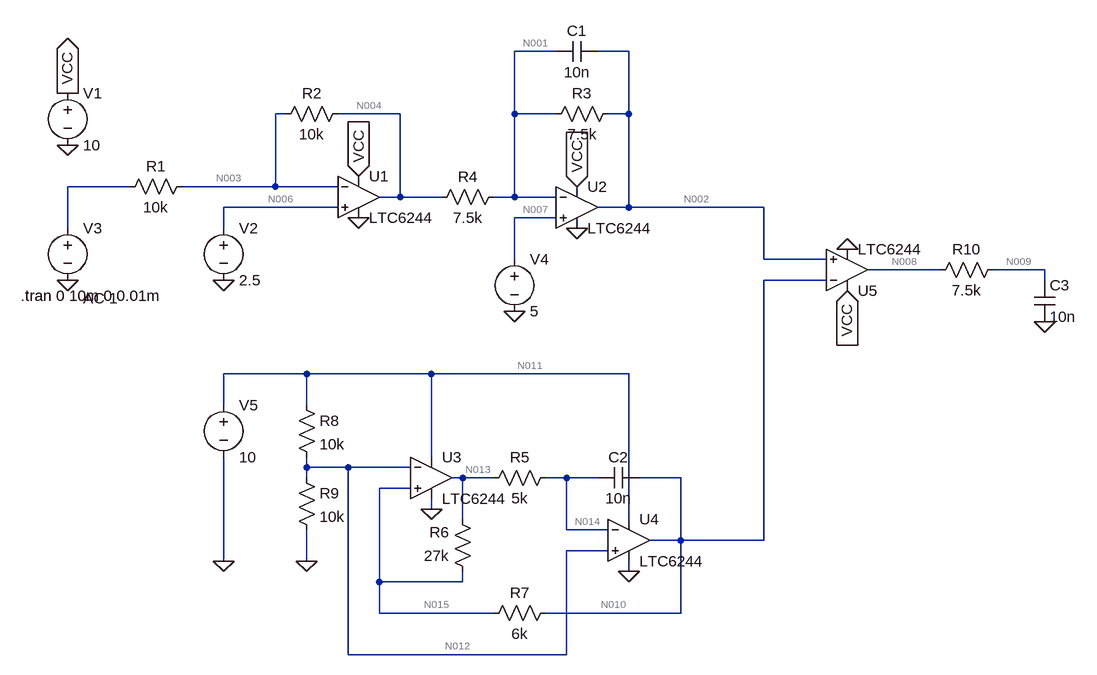
[diagram p0: schematic CombinedInput.asc]
CombinedInput.asc, the LTspice schematic file:
Version 4
SHEET 1 1496 884
WIRE 672 -48 608 -48
WIRE 784 -48 736 -48
WIRE 256 48 240 48
WIRE 432 48 336 48
WIRE 608 48 608 -48
WIRE 672 48 608 48
WIRE 784 48 784 -48
WIRE 784 48 752 48
WIRE 16 160 -80 160
WIRE 240 160 240 48
WIRE 240 160 96 160
WIRE 336 160 240 160
WIRE 432 176 432 48
WIRE 432 176 400 176
WIRE 496 176 432 176
WIRE 608 176 608 48
WIRE 608 176 576 176
WIRE 672 176 608 176
WIRE 336 192 160 192
WIRE 784 192 784 48
WIRE 784 192 736 192
WIRE 992 192 784 192
WIRE 672 208 608 208
WIRE -80 224 -80 160
WIRE 160 224 160 192
WIRE 608 272 608 208
WIRE 992 272 992 192
WIRE 1088 272 992 272
WIRE 1264 288 1152 288
WIRE 1424 288 1344 288
WIRE 1088 304 992 304
WIRE 1424 304 1424 288
WIRE 288 448 160 448
WIRE 480 448 288 448
WIRE 784 448 480 448
WIRE 160 496 160 448
WIRE 288 496 288 448
WIRE 480 576 480 448
WIRE 288 592 288 576
WIRE 352 592 288 592
WIRE 448 592 352 592
WIRE 288 608 288 592
WIRE 528 608 512 608
WIRE 576 608 528 608
WIRE 688 608 656 608
WIRE 736 608 688 608
WIRE 864 608 800 608
WIRE 448 624 400 624
WIRE 480 656 480 640
WIRE 528 672 528 608
WIRE 784 672 784 448
WIRE 688 688 688 608
WIRE 752 688 688 688
WIRE 864 704 864 608
WIRE 864 704 816 704
WIRE 992 704 992 304
WIRE 992 704 864 704
WIRE 752 720 688 720
WIRE 160 736 160 576
WIRE 288 736 288 688
WIRE 784 752 784 736
WIRE 400 768 400 624
WIRE 528 768 528 752
WIRE 528 768 400 768
WIRE 400 816 400 768
WIRE 576 816 400 816
WIRE 864 816 864 704
WIRE 864 816 656 816
WIRE 352 880 352 592
WIRE 688 880 688 720
WIRE 688 880 352 880
FLAG 368 208 0
FLAG -80 96 0
FLAG -80 304 0
FLAG 160 304 0
FLAG -80 16 VCC
IOPIN -80 16 Out
FLAG 368 144 VCC
IOPIN 368 144 In
FLAG 704 224 0
FLAG 704 160 VCC
IOPIN 704 160 In
FLAG 608 352 0
FLAG 1120 320 VCC
IOPIN 1120 320 In
FLAG 1120 256 0
FLAG 288 736 0
FLAG 480 656 0
FLAG 784 752 0
FLAG 160 736 0
FLAG 1424 368 0
SYMBOL Opamps\\LTC6244 368 176 R0
SYMATTR InstName U1
SYMBOL voltage -80 0 R0
WINDOW 123 0 0 Left 0
WINDOW 39 0 0 Left 0
SYMATTR InstName V1
SYMATTR Value 10
SYMBOL voltage 160 208 R0
WINDOW 123 0 0 Left 0
WINDOW 39 0 0 Left 0
SYMATTR InstName V2
SYMATTR Value 2.5
SYMBOL voltage -80 208 R0
WINDOW 123 24 124 Left 2
WINDOW 39 0 0 Left 0
WINDOW 3 24 96 Invisible 2
SYMATTR Value2 AC 1
SYMATTR InstName V3
SYMATTR Value SINE(0 1 200)
SYMBOL res 112 144 R90
WINDOW 0 0 56 VBottom 2
WINDOW 3 32 56 VTop 2
SYMATTR InstName R1
SYMATTR Value 10k
SYMBOL res 352 32 R90
WINDOW 0 0 56 VBottom 2
WINDOW 3 32 56 VTop 2
SYMATTR InstName R2
SYMATTR Value 10k
SYMBOL Opamps\\LTC6244 704 192 R0
SYMATTR InstName U2
SYMBOL res 768 32 R90
WINDOW 0 0 56 VBottom 2
WINDOW 3 32 56 VTop 2
SYMATTR InstName R3
SYMATTR Value 7.5k
SYMBOL res 592 160 R90
WINDOW 0 0 56 VBottom 2
WINDOW 3 32 56 VTop 2
SYMATTR InstName R4
SYMATTR Value 7.5k
SYMBOL cap 736 -64 R90
WINDOW 0 0 32 VBottom 2
WINDOW 3 32 32 VTop 2
SYMATTR InstName C1
SYMATTR Value 10n
SYMBOL voltage 608 256 R0
WINDOW 123 0 0 Left 0
WINDOW 39 0 0 Left 0
SYMATTR InstName V4
SYMATTR Value 5
SYMBOL Opamps\\LTC6244 1120 288 M180
SYMATTR InstName U5
SYMBOL res 672 592 R90
WINDOW 0 0 56 VBottom 2
WINDOW 3 32 56 VTop 2
SYMATTR InstName R5
SYMATTR Value 5k
SYMBOL res 544 768 R180
WINDOW 0 36 76 Left 2
WINDOW 3 36 40 Left 2
SYMATTR InstName R6
SYMATTR Value 27k
SYMBOL res 672 800 R90
WINDOW 0 0 56 VBottom 2
WINDOW 3 32 56 VTop 2
SYMATTR InstName R7
SYMATTR Value 6k
SYMBOL cap 800 592 R90
WINDOW 0 0 32 VBottom 2
WINDOW 3 32 32 VTop 2
SYMATTR InstName C2
SYMATTR Value 10n
SYMBOL res 272 480 R0
SYMATTR InstName R8
SYMATTR Value 10k
SYMBOL res 272 592 R0
SYMATTR InstName R9
SYMATTR Value 10k
SYMBOL voltage 160 480 R0
SYMATTR InstName V5
SYMATTR Value 10
SYMBOL OpAmps\\LTC6244 480 608 R0
SYMATTR InstName U3
SYMBOL OpAmps\\LTC6244 784 704 R0
SYMATTR InstName U4
SYMBOL cap 1408 304 R0
SYMATTR InstName C3
SYMATTR Value 10n
SYMBOL res 1360 272 R90
WINDOW 0 0 56 VBottom 2
WINDOW 3 32 56 VTop 2
SYMATTR InstName R10
SYMATTR Value 7.5k
TEXT -152 328 Left 2 !.tran 0 10m 0 0.01m

The netlist it stands for:
* CombinedInput.asc
XU1 N006 N003 VCC 0 N004 LTC6244  ; pins In+ In- V+ V- OUT
V1 VCC 0 10
V2 N006 0 2.5
V3 N005 0 SINE(0 1 200) AC 1
R1 N003 N005 10k
R2 N004 N003 10k
XU2 N007 N001 VCC 0 N002 LTC6244  ; pins In+ In- V+ V- OUT
R3 N002 N001 7.5k
R4 N001 N004 7.5k
C1 N002 N001 10n
V4 N007 0 5
XU5 N002 N010 VCC 0 N008 LTC6244  ; pins In+ In- V+ V- OUT
R5 N014 N013 5k
R6 N015 N013 27k
R7 N010 N015 6k
C2 N010 N014 10n
R8 N011 N012 10k
R9 N012 0 10k
V5 N011 0 10
XU3 N015 N012 N011 0 N013 LTC6244  ; pins In+ In- V+ V- OUT
XU4 N012 N014 N011 0 N010 LTC6244  ; pins In+ In- V+ V- OUT
C3 N009 0 10n
R10 N009 N008 7.5k
.tran 0 10m 0 0.01m
.backanno
.end

* Results of the author's LTspice run, read from the files saved beside the schematic
* Operating Point, zero values left out:
*   V(n003) = 2.5 V
*   V(n006) = 2.5 V
*   V(vcc) = 10 V
*   V(n004) = 5 V
*   V(n001) = 5 V
*   V(n007) = 5 V
*   V(n002) = 5 V
*   V(n010) = 5 V
*   V(n008) = 4.962 V
*   V(n014) = 5 V
*   V(n013) = 5 V
*   V(n015) = 5 V
*   V(n011) = 10 V
*   V(n012) = 5 V
*   V(n009) = 4.962 V
*   I(R9) = 500 µA
*   I(R8) = 500 µA
*   I(R4) = 3.193 pA
*   I(R3) = 3.193 pA
*   I(R2) = 250 µA
*   I(R1) = 250 µA
*   I(V5) = -12.08 mA
*   I(V3) = 250 µA
*   I(V1) = -17.49 mA